# Altium schematic sheet Schematic_2023-04-17.schdoc
size 290 x 199 mm
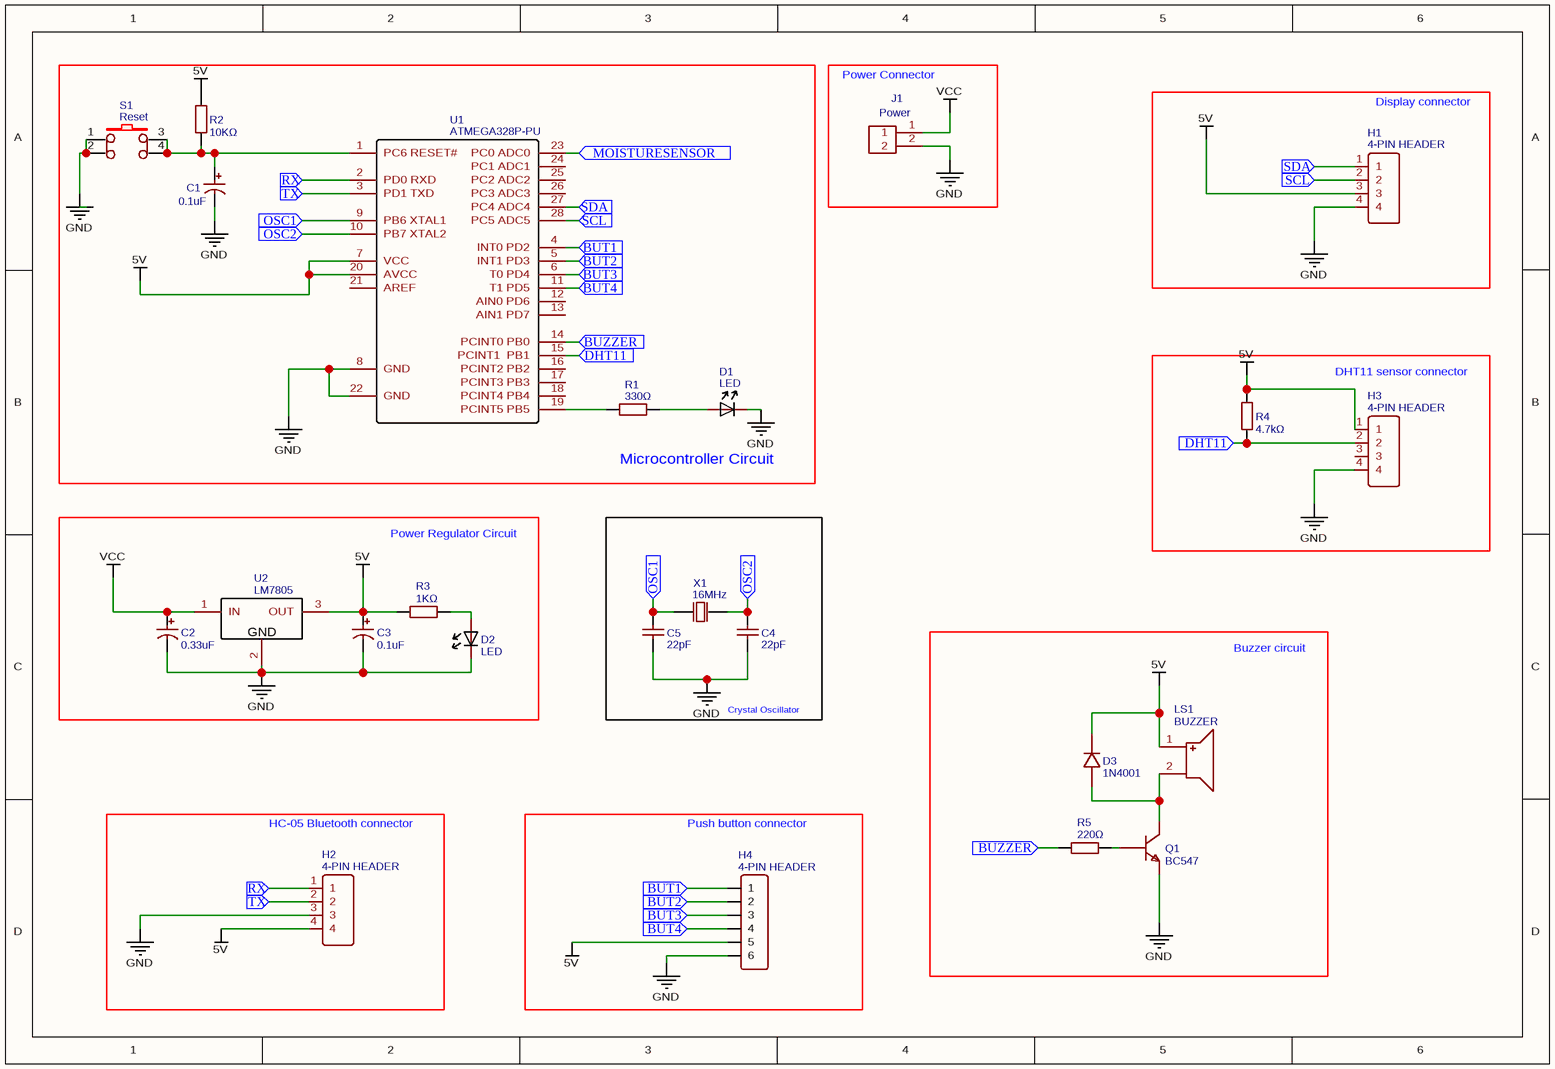
[diagram p0: Schematic_2023-04-17.schdoc]

## Parts
C1  0.1uF  [CAP-TH_BD5.0-P2.00-D0.8-FD]
C2  0.33uF  [CAP-TH_BD5.0-P2.00-D0.8-FD]
C3  0.1uF  [CAP-TH_BD5.0-P2.00-D0.8-FD]
C4  22pF  [CAP-TH_L3.5-W3.0-P2.54-D0.8]
C5  22pF  [CAP-TH_L3.5-W3.0-P2.54-D0.8]
D1  LED  [5MM LED]
D2  LED  [5MM LED]
D3  1N4001  [DO-41_BD2.4-L4.7-P8.70-D0.9-RD]
H1  4-PIN HEADER  [HEADER - HEADER-FEMALE-2.54_1X4]
H2  4-PIN HEADER  [HEADER - HEADER-FEMALE-2.54_1X4]
H3  4-PIN HEADER  [HEADER - HEADER-FEMALE-2.54_1X4]
H4  4-PIN HEADER  [HDR-F-2.54_1X6]
J1  Power  [CONN-TH_XHB-2A]
LS1  BUZZER  [DIP-BUZZER-12X6]
Q1  BC547  [TO-92-3_L4.9-W3.7-P2.54-L]
R1  330Ω  [AXIAL-0.4]
R2  10KΩ  [AXIAL-0.4]
R3  1KΩ  [AXIAL-0.4]
R4  4.7kΩ  [AXIAL-0.4]
R5  220Ω  [AXIAL-0.4]
S1  Reset  [KEY-TH_4P-L6.0-W6.0-P4.50]
U1  ATMEGA328P-PU  [DIP-28_L34.6-W7.3-P2.54-LS10.2-BL]
U2  LM7805  [TO-220-3_L10.0-W4.5-P2.54-L]
X1  16MHz  [CRYSTAL-TH_L10.8-W4.5-P4.88]

## Blocks framed on the sheet
Microcontroller Circuit: C1 D1 R1 R2 S1 U1
Power Connector: J1
Display connector: H1
DHT11 sensor connector: H3 R4
Power Regulator Circuit: C2 C3 D2 R3 U2
Crystal Oscillator: C4 C5 X1
Buzzer circuit: D3 LS1 Q1 R5
HC-05 Bluetooth connector: H2
Push button connector: H4

## Ports
BUT1 (in), BUT2 (in), BUT3 (in), BUT4 (in), BUZZER (in), DHT11 (in), MOISTURESENSOR (in), OSC1 (in), OSC2 (in), RX (in), SCL (in), SDA (in), TX (in)

## Nets
5V: C3.1 D3.1(C) H1.3 H2.4 H3.1 H4.5 LS1.1 R2.1 R3.1 R4.1 U1.7(VCC) U1.20(AVCC) U2.3(OUT)
GND: C1.2 C2.2 C3.2 C4.2 C5.2 D1.2 D2.2 H1.4 H2.3 H3.4 H4.6 J1.2 Q1.3(E) S1.1 S1.2 U1.8(GND) U1.22(GND) U2.2(GND)
VCC: C2.1 J1.1 U2.1(IN)
BUT1: H4.1 U1.4(INT0_PD2) ; port BUT1
BUT2: H4.2 U1.5(INT1_PD3) ; port BUT2
BUT3: H4.3 U1.6(T0_PD4) ; port BUT3
BUT4: H4.4 U1.11(T1_PD5) ; port BUT4
BUZZER: R5.1 U1.14(PCINT0_PB0) ; port BUZZER
DHT11: H3.2 R4.2 U1.15(PCINT1__PB1) ; port DHT11
MOISTURESENSOR: U1.23(PC0_ADC0) ; port MOISTURESENSOR
OSC1: C5.1 U1.9(PB6_XTAL1) X1.1 ; port OSC1
OSC2: C4.1 U1.10(PB7_XTAL2) X1.2 ; port OSC2
RX: H2.1 U1.2(PD0_RXD) ; port RX
SCL: H1.2 U1.28(PC5_ADC5) ; port SCL
SDA: H1.1 U1.27(PC4_ADC4) ; port SDA
TX: H2.2 U1.3(PD1_TXD) ; port TX
NetC1_1: C1.1 R2.2 S1.3 S1.4 U1.1(PC6_RESET#)
NetD1_1: D1.1 R1.2
NetD2_1: D2.1 R3.2
NetD3_2: D3.2(A) LS1.2 Q1.1(C)
NetQ1_2: Q1.2(B) R5.2
NetR1_1: R1.1 U1.19(PCINT5_PB5)

Not connected (* = marked no-connect by the designer): H3 3; U1 12(AIN0_PD6) 13(AIN1_PD7) 16(PCINT2_PB2) 17(PCINT3_PB3) 18(PCINT4_PB4) 21(AREF) 24(PC1_ADC1) 25(PC2_ADC2) 26(PC3_ADC3)

## Library data of the parts
C1 C3 = 0.1uF: BOM_Manufacturer: ValuePro; BOM_Manufacturer Part: 0.1UF 50V; nameAlias: Capacitance; BOM_Supplier: LCSC; BOM_Supplier Part: C28061; BOM_JLCPCB Part Class: Extended Part; spicePre: C; spiceSymbolName: 0.1uF
C2 = 0.33uF: BOM_Manufacturer: ValuePro; BOM_Manufacturer Part: 0.33uF 50V 5*11; nameAlias: Capacitance; BOM_Supplier: LCSC; BOM_Supplier Part: C45097; BOM_JLCPCB Part Class: Extended Part; spicePre: C; spiceSymbolName: 0.33uF
C4 C5 = 22pF: BOM_Manufacturer: ReliaPro; BOM_Manufacturer Part: 22pf/50V 10%; nameAlias: Capacitance; BOM_Supplier: LCSC; BOM_Supplier Part: C9316; BOM_JLCPCB Part Class: Extended Part; spicePre: C; spiceSymbolName: 22pf/50V 10%
D1 D2 = LED: Contributor: Axbri; BOM_Manufacturer Part: 5mm LED; Manufacturer Part: 5mm LED; spicePre: D; spiceSymbolName: LED
D3 = 1N4001: BOM_Manufacturer: Diodes Incorporated; Contributor: LCSC; BOM_Supplier: LCSC; BOM_Supplier Part: C99656; BOM_Manufacturer Part: 1N4001; BOM_JLCPCB Part Class: Extended Part; spicePre: D; spiceSymbolName: 1N4001
H1-H3 = 4-PIN HEADER: Contributor: Kang Yi Te; BOM_Supplier: Sparkfun; spicePre: H; spiceSymbolName: HEADER - HEADER-FEMALE-2.54_1X4
H4 = 4-PIN HEADER: Contributor: LCEDA_Lib; BOM_Supplier Part: C40877; BOM_Supplier: LCSC; spicePre: H; spiceSymbolName: HDR-F-2.54_1x6
J1 = Power: BOM_Manufacturer: BOOMELE; BOM_Manufacturer Part: XHB-2A Connector; BOM_Supplier: LCSC; image: //image.lceda.cn/szlcsc/C57981.jpg; BOM_Supplier Part: C57981; BOM_JLCPCB Part Class: Extended Part; spicePre: J; spiceSymbolName: JST_2 PIN
LS1 = BUZZER: BOM_Manufacturer: HNDZ; BOM_Manufacturer Part: BUZZERHMB1206-03; Contributor: วริศรา เกรียงไกรวัฒน์ /ทิพพะ; BOM_Supplier: LCSC; BOM_Supplier Part: C96101; spicePre: L; spiceSymbolName: BUZZER
Q1 = BC547: BOM_Manufacturer: onsemi(安森美); BOM_Manufacturer Part: BC547BTF; Contributor: LCSC; BOM_Supplier: LCSC; BOM_Supplier Part: C900798; BOM_JLCPCB Part Class: Extended Part; spicePre: Q; spiceSymbolName: BC547BTF
R1 = 330Ω: BOM_Manufacturer: UniOhm; BOM_Manufacturer Part: MFR0W4F2200A50; Power: 1/4W; Tolerance: ±1%; BOM_EasyEDA: E57439; Value: Value; BOM_Supplier Part: E57439; BOM_Supplier: LCSC; spicePre: R; spiceSymbolName: RESISTOR
R2 = 10KΩ: BOM_Manufacturer: UniOhm; BOM_Manufacturer Part: MFR0W4F2200A50; Power: 1/4W; Tolerance: ±1%; BOM_EasyEDA: E57439; Value: Value; BOM_Supplier Part: E57439; BOM_Supplier: LCSC; spicePre: R; spiceSymbolName: RESISTOR
R3 = 1KΩ: BOM_Manufacturer: UniOhm; BOM_Manufacturer Part: MFR0W4F2200A50; Power: 1/4W; Tolerance: ±1%; BOM_EasyEDA: E57439; Value: Value; BOM_Supplier Part: E57439; BOM_Supplier: LCSC; spicePre: R; spiceSymbolName: RESISTOR
R4 = 4.7kΩ: BOM_Manufacturer: UniOhm; BOM_Manufacturer Part: MFR0W4F2200A50; Power: 1/4W; Tolerance: ±1%; BOM_EasyEDA: E57439; Value: Value; BOM_Supplier Part: E57439; BOM_Supplier: LCSC; spicePre: R; spiceSymbolName: RESISTOR
R5 = 220Ω: BOM_Manufacturer: UniOhm; BOM_Manufacturer Part: MFR0W4F2200A50; Power: 1/4W; Tolerance: ±1%; BOM_EasyEDA: E57439; Value: Value; BOM_Supplier Part: E57439; BOM_Supplier: LCSC; spicePre: R; spiceSymbolName: RESISTOR
S1 = Reset: BOM_Manufacturer: ReliaPro; BOM_Manufacturer Part: button6*6*8.5; BOM_Supplier Part: C59980; BOM_Supplier: LCSC; image: http://image.lceda.cn/szlcsc/C59980.jpg; spicePre: S; spiceSymbolName: Push_Button
U1 = ATMEGA328P-PU: BOM_Manufacturer: MICROCHIP(美国微芯); sourceId: Oic6oiASL; Contributor: LCSC; timeStamp: 1451725987; BOM_Supplier: LCSC; BOM_Manufacturer Part: ATMEGA328P-PU; BOM_Supplier Part: C33901; BOM_JLCPCB Part Class: Extended Part; spicePre: U; spiceSymbolName: ATMEGA328P-PU
U2 = LM7805: BOM_Manufacturer: STMicroelectronics; BOM_Manufacturer Part: L7805CV-DG; Contributor: LCEDA_Lib; BOM_Supplier: LCSC; BOM_Supplier Part: C3795; spicePre: U; spiceSymbolName: 7805(TO-220)
X1 = 16MHz: BOM_Manufacturer: CTS(西迪斯); BOM_Manufacturer Part: ATS16A; Contributor: lcsc; nameAlias: Frequency; BOM_Supplier: LCSC; BOM_Supplier Part: C1669847; link: https://atta.szlcsc.com/upload/public/pdf/source/20200318/C487700_6E42144C1E843ECF848E205586EC895F.pdf; spicePre: X; spiceSymbolName: ATS16A